# EAGLE design glowproxy.alpha (EAGLE 6.5.0)
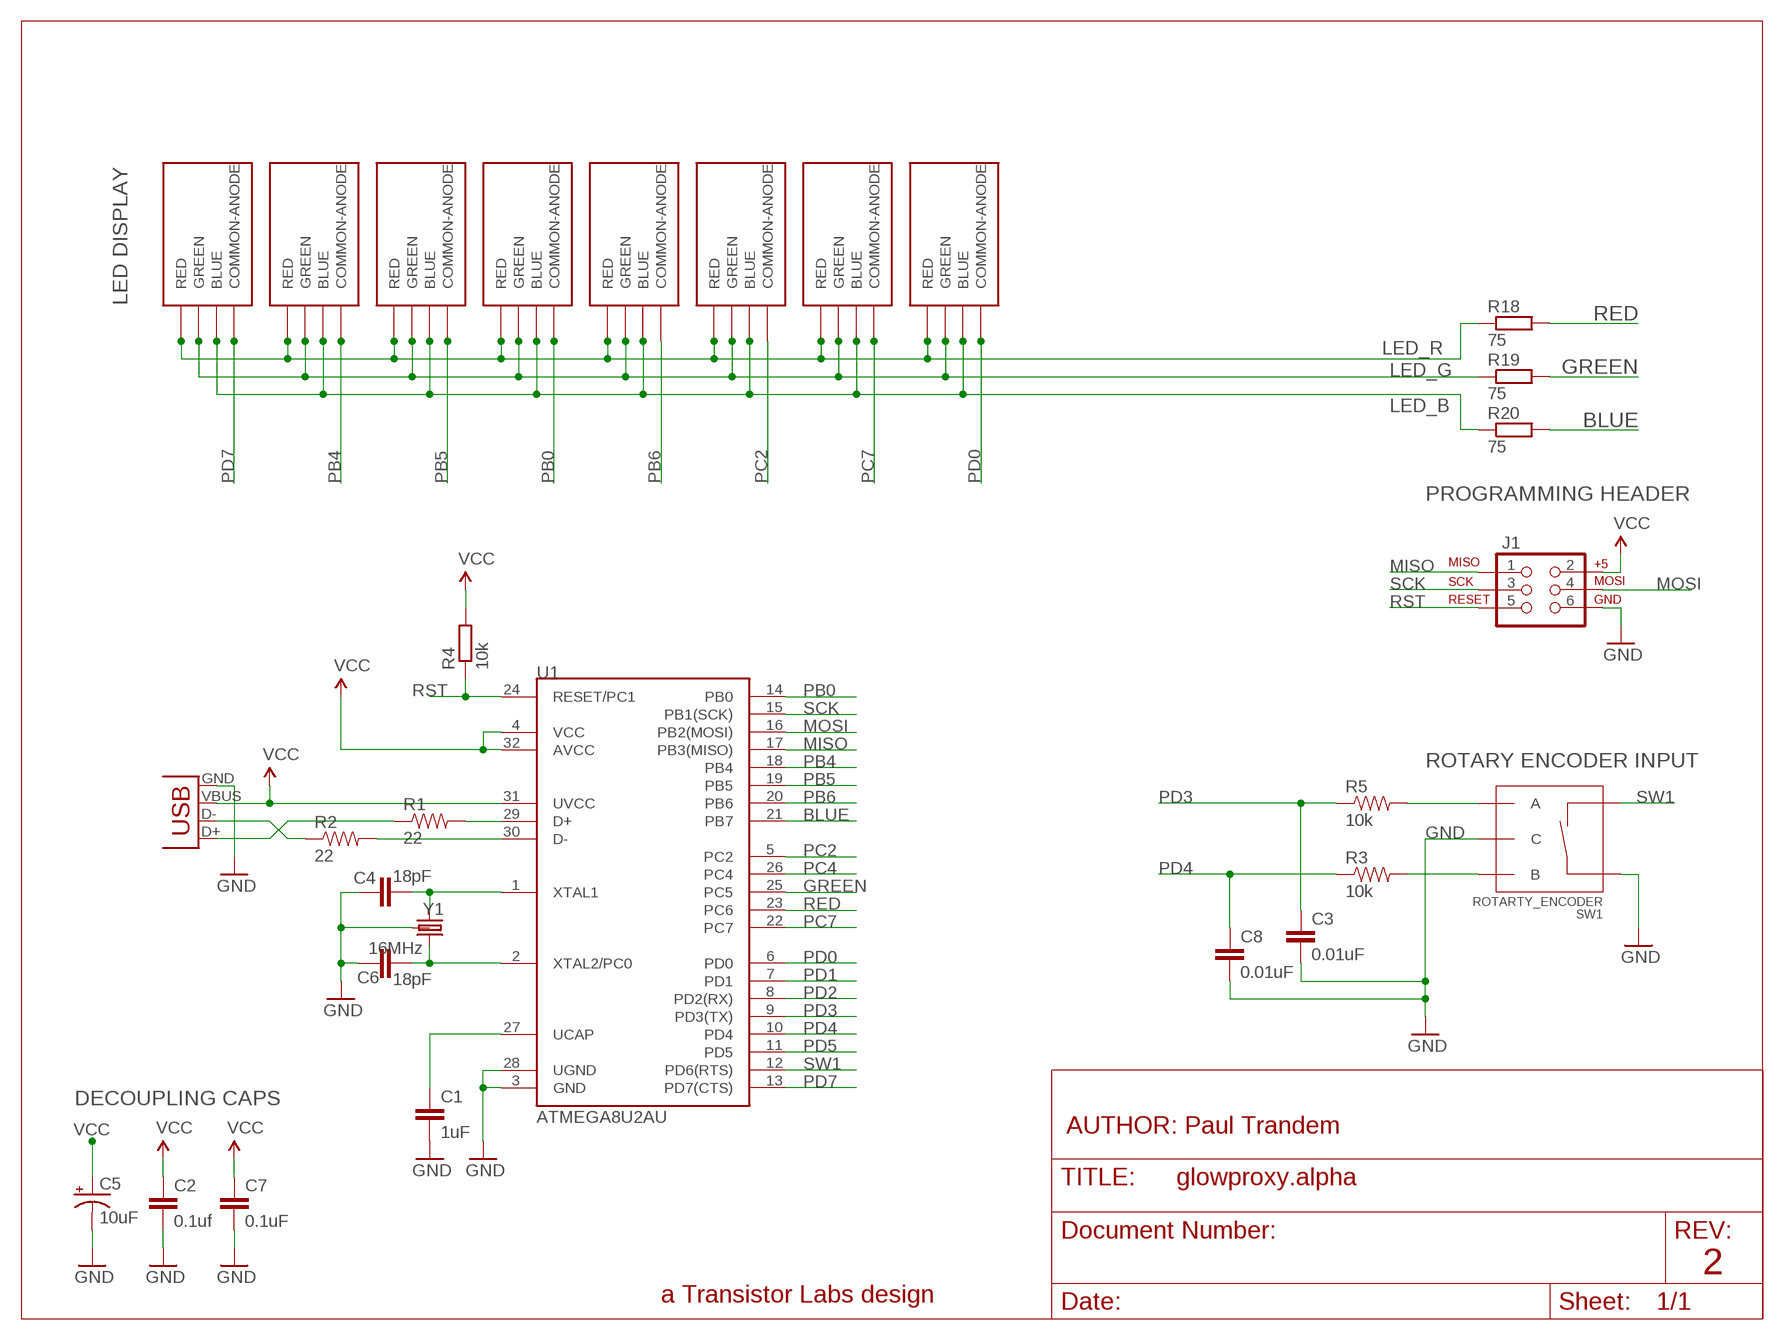
[diagram p0: schematic, sheet 1]

## Parts
C1  1uF  C-EUC0603  [C0603]
C2  0.1uf  C-EUC0603  [C0603]
C3  0.01uF  C-EUC0603  [C0603]
C4  18pF  CAP0603-CAP  [0603-CAP]
C5  10uF  CAP_POL1206  [EIA3216]
C6  18pF  CAP0603-CAP  [0603-CAP]
C7  0.1uF  C-EUC0603  [C0603]
C8  0.01uF  C-EUC0603  [C0603]
J1  AVR_SPI_PRG_6PTH  [2X3]
LED0  RGB-LED-SMD-CLV1A-FKB  [RGB-LED-SMD-CLV1A-FKB]
LED1  RGB-LED-SMD-CLV1A-FKB  [RGB-LED-SMD-CLV1A-FKB]
LED2  RGB-LED-SMD-CLV1A-FKB  [RGB-LED-SMD-CLV1A-FKB]
LED3  RGB-LED-SMD-CLV1A-FKB  [RGB-LED-SMD-CLV1A-FKB]
LED4  RGB-LED-SMD-CLV1A-FKB  [RGB-LED-SMD-CLV1A-FKB]
LED5  RGB-LED-SMD-CLV1A-FKB  [RGB-LED-SMD-CLV1A-FKB]
LED6  RGB-LED-SMD-CLV1A-FKB  [RGB-LED-SMD-CLV1A-FKB]
LED7  RGB-LED-SMD-CLV1A-FKB  [RGB-LED-SMD-CLV1A-FKB]
R1  22  RESISTOR0603-RES  [0603-RES]
R2  22  RESISTOR0603-RES  [0603-RES]
R3  10k  RESISTOR0603-RES  [0603-RES]
R4  10k  R-EU_R0603  [R0603]
R5  10k  RESISTOR0603-RES  [0603-RES]
R18  75  R-EU_R0603  [R0603]
R19  75  R-EU_R0603  [R0603]
R20  75  R-EU_R0603  [R0603]
SW1  ROTARTY_ENCODER  [ROTARY_ENC_PLAIN]
U1  ATMEGA8U2AU  [TQFP32-08]
X1  USBSMD  [USB-MINIB]
Y1  16MHz  CRYSTAL5X3  [CRYSTAL-SMD-5X3]

## Nets
BLUE: R20.2 U1.21(PB7)
DP_N: R2.2 U1.30(D-)
DP_P: R1.2 U1.29(D+)
GND: C1.2 C2.2 C3.2 C4.2 C5.C(-) C6.2 C7.2 C8.2 J1.6 SW1.C SW1.SW+ U1.3(GND) U1.28(UGND) X1.GND Y1.2(GND) Y1.4(GND)
GREEN: R19.2 U1.25(PC5)
LED_B: LED0.BLUE LED1.BLUE LED2.BLUE LED3.BLUE LED4.BLUE LED5.BLUE LED6.BLUE LED7.BLUE R20.1
LED_G: LED0.GREEN LED1.GREEN LED2.GREEN LED3.GREEN LED4.GREEN LED5.GREEN LED6.GREEN LED7.GREEN R19.1
LED_R: LED0.RED LED1.RED LED2.RED LED3.RED LED4.RED LED5.RED LED6.RED LED7.RED R18.1
MISO: J1.1 U1.17(PB3(MISO))
MOSI: J1.4 U1.16(PB2(MOSI))
N$1: R5.2 SW1.A
N$2: R3.2 SW1.B
N$8: C4.1 U1.1(XTAL1) Y1.3
N$9: C6.1 U1.2(XTAL2/PC0) Y1.1
N$12: C1.1 U1.27(UCAP)
PB0: LED4.COMMON-ANODE U1.14(PB0)
PB4: LED0.COMMON-ANODE U1.18(PB4)
PB5: LED7.COMMON-ANODE U1.19(PB5)
PB6: LED5.COMMON-ANODE U1.20(PB6)
PC2: LED1.COMMON-ANODE U1.5(PC2)
PC4: U1.26(PC4)
PC7: LED6.COMMON-ANODE U1.22(PC7)
PD0: LED2.COMMON-ANODE U1.6(PD0)
PD1: U1.7(PD1)
PD2: U1.8(PD2(RX))
PD3: C3.1 R5.1 U1.9(PD3(TX))
PD4: C8.1 R3.1 U1.10(PD4)
PD5: U1.11(PD5)
PD7: LED3.COMMON-ANODE U1.13(PD7(CTS))
RED: R18.2 U1.23(PC6)
RST: J1.5 R4.1 U1.24(RESET/PC1)
SCK: J1.3 U1.15(PB1(SCK))
SW1: SW1.SW- U1.12(PD6(RTS))
USBD_N: R2.1 X1.D-
USBD_P: R1.1 X1.D+
VCC: C2.1 C5.A(+) C7.1 J1.2 R4.2 U1.4(VCC) U1.31(UVCC) U1.32(AVCC) X1.VBUS

## Notes on the sheet
- LED DISPLAY
- PROGRAMMING HEADER
- ROTARY ENCODER INPUT
- DECOUPLING CAPS
- AUTHOR: Paul Trandem
- 2
- a Transistor Labs design

## Library data of the parts
C1-C3 C7 C8 = TransistorLabs.Resistor.mod:C-EU: CAPACITOR, European symbol
C4 C6 = SparkFun:CAP: Capacitor Standard 0603 ceramic capacitor, and 0.1" leaded capacitor.
C5 = SparkFun:CAP_POL: Capacitor Polarized These are standard SMD and PTH capacitors. Normally 10uF, 47uF, and 100uF in electrolytic and tantalum varieties. Always verify the external diameter of the through hole cap, it varies with capacity, voltage, and manufacturer. The EIA devices should be standard.
J1 = SparkFun:AVR_SPI_PRG_6: AVR ISP 6 Pin This is the reduced ISP connector for AVR programming. Common on Arduino. This footprint will take up less PCB space and can be used with a 10-pin to 6-pin adapter such as SKU: BOB-08508
LED0 LED1-LED7 = thump:RGB-LED-SMD-CLV1A-FKB: RGB LED PLCC4 CREE CLV1A-FKB
R1-R3 R5 = SparkFun:RESISTOR: Resistor Basic schematic elements and footprints for 0603, 1206, and PTH resistors.
R4 R18-R20 = TransistorLabs.Resistor.mod:R-EU_: RESISTOR, European symbol
SW1 = SparkFun-Electromechanical:ROTARTY_ENCODER: Simple no LED rotary encoder Example: COM-09117
U1 = SparkFun:ATMEGA8U2: Atmel 8-bit Microcontroller with 8/16/32K Bystes of ISP Flash and USB Controller. ATmega8U2, ATmega16U2, and ATmega32U2
X1 = SparkFun:USB: USB Connectors USB-B-PTH is fully proven SKU : PRT-00139 USB-miniB is fully proven SKU : PRT-00587 USB-A-PCB is untested. USB-A-H is throughly reviewed, but untested. Spark Fun Electronics SKU : PRT-00437 USB-B-SMT is throughly reviewed, but untested. Needs silkscreen touching up. USB-A-S has not been used/tested USB-MB-H has not been used/tested
Y1 = Transistorlabs:CRYSTAL: Custom crystals

## Board
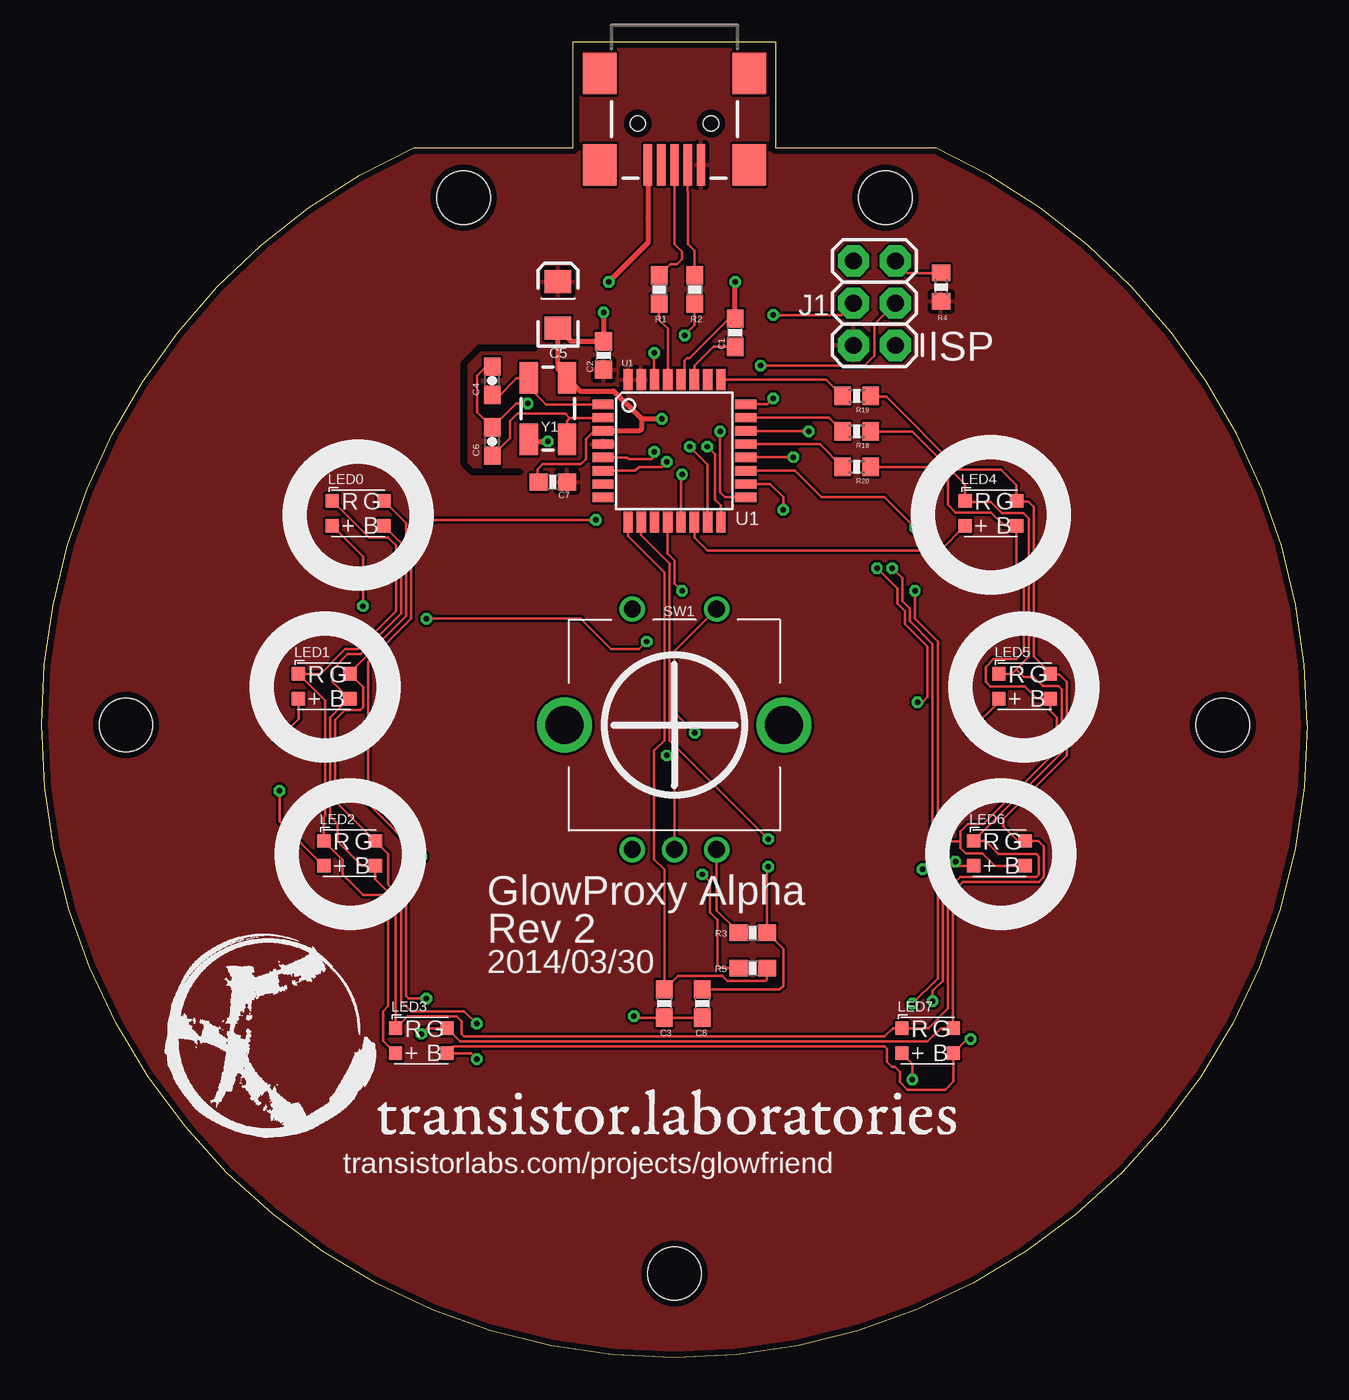
[diagram p1: board, top side]
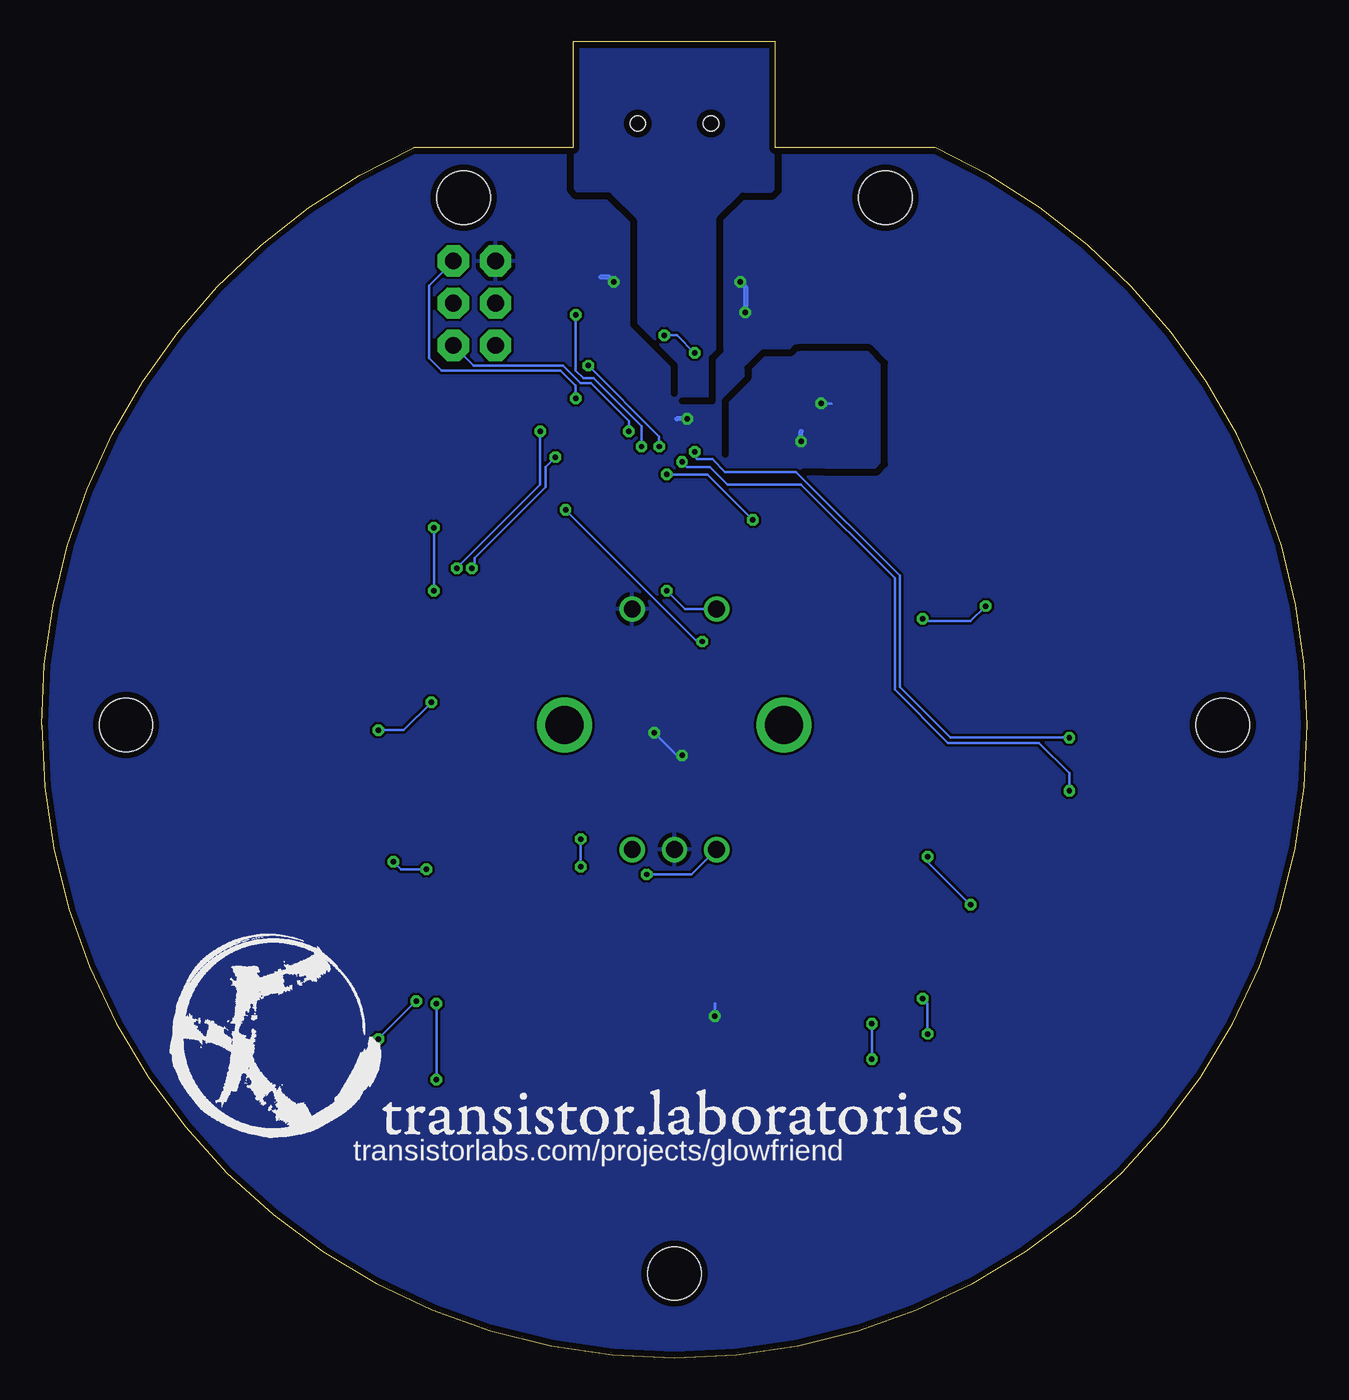
[diagram p2: board, bottom side, seen from below]

Size 76.2 x 79.25 mm. Coordinates in mm from the lower left corner, seen from the top.
Outline: 76.2,38.1 arc-180 0,38.1 arc-66 22.4,72.85 32,72.85 32,79.25 44.2,79.25 44.2,72.85 53.8,72.85 arc-66 76.2,38.1
Copper layers (1*16): Top 0.0356mm / dielectric 1.5011mm / Bottom 0.0356mm
Design rules "LaenPCBOrder": minimum track width 6mil, minimum drill 13mil, track to track 6mil, track to pad 6mil, pad to pad 6mil, via to via 6mil, smd to smd 6mil, copper to edge 15mil, drill to drill 6mil, minimum pad ring 7mil, minimum via ring 7mil, stop-mask expansion 3mil, vias tented up to drill 0mil, thermal gap 10mil
Holes 3.2 mm at 5.08,38.1 71.12,38.1 38.1,5.08 25.4,69.85 50.8,69.85
tRestrict: 5 lines
bRestrict: 27 lines

### Footprints (pad centres in the part's own frame; a part is rotated, then mirrored left to right if it is on the bottom)
C0603 = smd 1.1 x 1: 1 -0.85,0; 2 0.85,0
0603-CAP = smd 1.1 x 1: 1 -0.85,0; 2 0.85,0
EIA3216 = smd 1.4 x 1.6: A 1.4,0; C -1.4,0
2X3 = drill 1.016 pad 1.88 octagon: 1 0,0; 2 0,2.54; 3 2.54,0; 4 2.54,2.54; 5 5.08,0; 6 5.08,2.54
RGB-LED-SMD-CLV1A-FKB = smd 0.8 x 0.8: BLUE 1.55,-0.7; COMMON-ANODE -1.55,-0.7; GREEN 1.55,0.8; RED -1.55,0.8
0603-RES = smd 1.1 x 1: 1 -0.85,0; 2 0.85,0
R0603 = smd 1 x 1.1: 1 -0.85,0; 2 0.85,0
ROTARY_ENC_PLAIN = drill 1.016: A 7.493,-2.54; B 7.493,2.54; C 7.493,0; SW+ -6.985,2.54; SW- -6.985,-2.54 | drill 2.286: P$3 0,6.604; P$4 0,-6.604
TQFP32-08 = smd 1.27 x 0.559: 1 -4.293,2.8; 2 -4.293,2; 3 -4.293,1.2; 4 -4.293,0.4; 5 -4.293,-0.4; 6 -4.293,-1.2; 7 -4.293,-2; 8 -4.293,-2.8; 17 4.293,-2.8; 18 4.293,-2; 19 4.293,-1.2; 20 4.293,-0.4; 21 4.293,0.4; 22 4.293,1.2; 23 4.293,2; 24 4.293,2.8 | smd 0.559 x 1.27: 9 -2.8,-4.293; 10 -2,-4.293; 11 -1.2,-4.293; 12 -0.4,-4.293; 13 0.4,-4.293; 14 1.2,-4.293; 15 2,-4.293; 16 2.8,-4.293; 25 2.8,4.293; 26 2,4.293; 27 1.2,4.293; 28 0.4,4.293; 29 -0.4,4.293; 30 -1.2,4.293; 31 -2,4.293; 32 -2.8,4.293
USB-MINIB = smd 2.5 x 0.5: D+ 2.5,0; D- 2.5,0.8; GND 2.5,-1.6; ID 2.5,-0.8; VBUS 2.5,1.6 | smd 2.5 x 2: MTN1 -3,4.5; MTN2 2.5,4.5; MTN3 -3,-4.5; MTN4 2.5,-4.5 | hole 0.9: 0,2.2; 0,-2.2
CRYSTAL-SMD-5X3 = smd 1.9 x 1.1: 1 -1.85,-1.15; 2 1.85,-1.15; 3 1.85,1.15; 4 -1.85,1.15

### Placement (x,y rotation side)
C1  41.76,61.72 90 top
C2  33.83,60.35 90 top
C3  37.49,21.34 270 top
C4  27.13,58.83 90 top
C5  31.09,63.4 90 top
C6  27.13,55.17 90 top
C7  30.78,52.73 180 top
C8  39.78,21.34 270 top
J1  51.41,60.96 90 top
LED0  19.05,50.8 0 top
LED1  17.02,40.39 0 top
LED2  18.54,30.33 0 top
LED3  22.86,19.05 0 top
LED4  57.15,50.8 0 top
LED5  59.18,40.39 0 top
LED6  57.66,30.33 0 top
LED7  53.34,19.05 0 top
R1  37.19,64.31 270 top
R2  39.32,64.31 270 top
R3  42.82,25.6 180 top
R4  54.15,64.47 270 top
R5  42.82,23.47 180 top
R18  49.07,55.78 180 top
R19  49.07,57.91 180 top
R20  49.07,53.64 180 top
SW1  38.1,38.1 270 top
U1  38.1,54.61 0 top
U$1  [TL-LOGO]  6.4,19.05 0 top
U$2  [TL-LOGO]  69.49,19.05 0 bottom
X1  38.1,74.32 270 top
Y1  30.48,57.15 90 top

### Tracks (layer width: path | path; a pad name or v marks a point on that pad's centre or on a via)
BLUE
  Top 0.152: U1.21 46.86,55.01 R20.2
DP_N  (via drill 0.33)
  Top 0.152: R2.2 39.32,62.18 v38.71,61.57 | v36.88,60.5 36.88,58.92 U1.30
  Bottom 0.152: v38.71,61.57 37.95,61.57 v36.88,60.5
DP_P
  Top 0.152: R1.2 37.19,62.48 37.7,61.97 U1.29
GND  (via drill 0.33)
  Top 0.152: SW1.SW+ 38.1,42.55 38.1,38.86 v39.32,37.64 | v37.64,36.27 38.1,35.81 SW1.C | v29.26,57.45 28.56,57.45 C6.2 26.21,56.93 26.21,59.13 26.76,59.68 C4.2 | C7.2 29.87,52.8 29.87,53.49 30.18,53.8 32.46,53.8 32.77,54.1 32.77,55.32 33.26,55.81 U1.3 | U1.28 38.71,59.11 38.71,60.05 38.86,60.2 39.01,60.2 41.39,62.57 C1.2 | C8.2 C3.2 35.75,20.49 v35.66,20.57
  Top 0.305: X1.GND 36.5,68.62 36.5,67.13 v34.14,64.77 34.14,64.85 | v33.83,62.94 C2.2 31.89,61.2 C5.C 31.09,59.54 Y1.2 32.41,58.22 34.44,58.22 36.12,56.54 | 36.12,56.54 36.12,55.93 36,55.81 U1.3 | C1.2 v41.76,64.77 | 36.12,56.54 v37.34,56.54 | Y1.4 29.46,55.17 v30.48,55.17
  Bottom 0.152: v39.32,37.64 37.95,36.27 v37.64,36.27 | v29.26,57.45 28.65,57.45 | v35.66,20.57 35.66,21.34
  Bottom 0.305: v34.14,64.77 33.83,64.47 v33.83,62.94 | v41.76,64.77 42.06,65.08 42.52,65.08 | v37.34,56.54 37.95,56.54 | v30.48,55.17 30.48,55.78
  pour Bottom: -0.15,38.56 -0.3,39.62 arc-90 38.86,80.31 arc-90 76.05,29.87 arc-68 41.61,-1.22 arc-90
GREEN
  Top 0.152: U1.25 47.23,58.9 R19.2
LED_B  (via drill 0.33)
  Top 0.152: R20.1 54.1,53.65 54.56,53.19 54.56,51.36 55.02,50.9 57.15,50.9 57.95,50.1 LED4.BLUE 58.67,50.07 58.67,47.7 59.13,47.24 59.13,42.52 58.67,42.06 57.3,42.06 56.84,41.6 56.84,40.69 57.12,40.41 59.21,40.41 59.93,39.69 LED5.BLUE 60.73,38.94 61.11,38.56 61.11,36.58 56.69,32.16 55.78,32.16 55.32,31.7 55.32,31.09 | v53.65,21.49 53.65,22.1 54.25,22.71 54.25,30.63 54.71,31.09 55.32,31.09 | v55.93,19.2 55.74,19.2 LED7.BLUE 54.89,16.64 54.41,16.15 52.12,16.15 51.66,16.61 51.66,17.22 51.36,17.53 51.21,17.53 50.9,17.83 50.9,18.59 50.75,18.75 24.8,18.75 LED3.BLUE 25.85,18.35 v26.21,17.98 | 20.57,50.07 LED0.BLUE 21.64,49.06 21.64,44.81 19.2,42.37 18.44,42.37 17.53,41.45 17.53,40.69 18.53,39.69 LED1.BLUE 18.5,39.69 17.37,38.56 17.37,32.61 17.83,32.16 17.83,31.09 19.29,29.63 LED2.BLUE 20.09,28.83 21.64,27.28 21.64,21.49 22.25,20.88 25.45,20.88 v26.21,20.12 | 55.32,31.09 55.32,30.71 55.65,30.38 56.64,30.38 57.39,29.63 LED6.BLUE
  Bottom 0.152: v53.65,21.49 v55.93,19.2 | v26.21,20.12 v26.21,17.98
LED_G  (via drill 0.33)
  Top 0.152: R19.1 49.97,57.86 50.85,57.86 55.22,53.49 57.76,53.49 58.7,52.55 LED4.GREEN 58.74,51.56 59.41,51.56 59.74,51.23 59.74,42.22 60.73,41.22 LED5.GREEN 60.77,41.15 61.27,41.15 61.72,40.69 61.72,36.27 57.91,32.46 57.91,32 58.79,31.13 LED6.GREEN 60.01,31.13 60.35,30.79 60.35,28.96 60.05,28.65 55.47,28.65 54.86,28.04 54.86,19.88 LED7.GREEN 54.14,19.85 53.34,19.05 25.21,19.05 LED3.GREEN 23.2,19.85 v22.86,19.51 | v23.16,21.64 22.1,21.64 21.95,21.79 21.95,27.43 20.88,28.5 20.88,30.34 LED2.GREEN 17.68,33.54 17.68,38.41 18.29,39.01 19.2,39.01 19.36,39.17 19.36,40.4 LED1.GREEN 18.57,41.28 21.95,44.65 21.95,50.25 LED0.GREEN
  Bottom 0.152: v23.16,21.64 22.86,21.34 v22.86,19.51
LED_R
  Top 0.152: R18.1 52.43,55.78 55.6,52.6 LED4.RED 55.69,51.51 57.15,51.51 57.81,50.85 59.11,50.85 59.44,50.52 59.44,42.22 58.67,41.45 | LED0.RED 19.72,49.38 20.88,49.38 21.34,48.92 21.34,44.96 19.05,42.67 18.29,42.67 16.8,41.19 LED1.RED 17.07,39.59 17.07,32.61 16.99,32.54 LED2.RED 18.14,29.98 18.14,29.11 19.36,27.89 20.57,27.89 21.31,27.15 LED3.RED 22.03,20.57 24.99,20.57 25.3,20.27 25.3,19.51 25.45,19.36 50.75,19.36 51.24,19.85 LED7.RED 53.38,19.85 54.56,21.03 54.56,28.19 55.32,28.96 59.89,28.96 60.05,29.11 60.05,30.18 59.89,30.33 57.61,30.33 56.81,31.13 LED6.RED 61.42,36.44 61.42,40.23 61.21,40.44 60.27,40.44 59.72,41 59.13,41 58.67,41.45 | 58.67,41.45 58.41,41.19 LED5.RED
MISO  (via drill 0.33)
  Top 0.152: U1.17 41.15,51.81 40.84,52.12 v40.84,55.78
  Bottom 0.152: v40.84,55.78 40.84,56.39 43.13,58.67 43.74,58.67 44.81,59.74 50.19,59.74 J1.1
MOSI  (via drill 0.33)
  Top 0.152: U1.16 40.9,51.3 40.54,51.66 40.54,54.41 v40.08,54.86 | v44.04,62.79 48.16,62.79 J1.4
  Bottom 0.152: v40.08,54.86 40.08,56.08 42.98,58.98 43.59,58.98 44.04,59.44 v44.04,62.79
N$1  (via drill 0.33)
  Top 0.152: R5.2 40.84,23.47 40.69,23.62 40.69,26.36 40.23,26.82 40.23,28.65 v39.78,29.11
  Bottom 0.152: v39.78,29.11 37.06,29.11 SW1.A
N$2
  Top 0.152: SW1.B 40.64,26.94 R3.2
N$8
  Top 0.152: U1.1 30.38,57.4 29.33,58.45 Y1.3 29.31,58.98 28.6,58.98 27.6,57.98 C4.1
N$9
  Top 0.152: U1.2 33.79,56.59 31.8,56.59 | Y1.1 31.62,56.41 31.8,56.59 | C6.1 28.19,55.39 28.19,56.39 28.65,56.84 31.55,56.84 31.8,56.59
N$12
  Top 0.152: U1.27 39.32,58.92 39.32,59.74 40.45,60.87 C1.1
PB0
  Top 0.152: LED4.COMMON-ANODE 54.12,48.62 40.08,48.62 39.3,49.4 U1.14
PB4  (via drill 0.33)
  Top 0.152: 17.87,50.1 LED0.COMMON-ANODE 19.36,48.24 v19.36,45.26 | v23.16,44.5 32.46,44.5 34.29,42.67 35.97,42.67 v36.42,43.13 | v44.65,51.05 44.65,51.82 43.86,52.61 U1.18
  Bottom 0.152: v23.16,44.5 23.01,44.35 20.27,44.35 v19.36,45.26 | v36.42,43.13 36.73,43.13 v44.65,51.05
PB5  (via drill 0.33)
  Top 0.152: U1.19 45.34,53.41 46.94,51.82 50.75,51.82 v52.58,49.99 | v52.43,21.34 53.95,22.86 53.95,43.13 52.58,44.5 v52.58,46.18 | v52.43,16.76 52.43,17.71 LED7.COMMON-ANODE
  Bottom 0.152: v52.43,21.34 v52.43,16.76 | v52.58,49.99 v52.58,46.18
PB6  (via drill 0.33)
  Top 0.152: U1.20 42.41,54.23 v45.26,54.23 | v50.29,47.55 51.51,46.33 51.51,45.41 51.97,44.96 51.97,44.2 53.34,42.82 53.34,39.78 53.03,39.47 v52.73,39.47 | v55.93,37.8 57.63,39.5 LED5.COMMON-ANODE
  Bottom 0.152: v45.26,54.23 45.87,53.62 45.87,52.43 50.14,48.16 50.14,47.7 v50.29,47.55 | v52.73,39.47 54.41,37.8 v55.93,37.8
PC2  (via drill 0.33)
  Top 0.152: v14.33,37.34 15.47,38.48 LED1.COMMON-ANODE | v36.88,54.56 36.88,54.25 36.73,54.1 35.36,54.1 35.25,54.21 U1.5
  Bottom 0.152: v14.33,37.34 21.49,37.34 24.54,40.39 24.54,47.09 30.79,53.34 35.05,53.34 35.81,54.1 36.73,54.1 36.88,54.25 v36.88,54.56
PC7  (via drill 0.33)
  Top 0.152: U1.22 46.15,55.81 v46.18,55.78 | v51.21,47.55 51.82,46.94 51.82,45.57 52.27,45.11 52.27,44.35 53.65,42.98 53.65,29.87 53.19,29.41 v53.03,29.41 | LED6.COMMON-ANODE 55.26,29.63 v55.02,29.87
  Bottom 0.152: v46.18,55.78 46.18,52.58 v51.21,47.55 | v55.02,29.87 54.56,29.41 v53.03,29.41
PD0  (via drill 0.33)
  Top 0.152: v14.33,34.14 14.33,32.29 LED2.COMMON-ANODE | v37.64,53.95 37.34,53.65 35.97,53.65 35.73,53.41 U1.6
  Bottom 0.152: v14.33,34.14 14.33,35.2 16.15,37.03 21.64,37.03 24.84,40.23 24.84,46.94 30.48,52.58 34.9,52.58 35.97,53.65 37.34,53.65 v37.64,53.95
PD3
  Top 0.152: U1.9 35.31,49.48 37.49,47.3 37.49,37.19 36.88,36.58 36.88,30.02 37.49,29.41 C3.1 38.32,23.01 41,23.01 41.3,22.71 43.59,22.71 43.67,22.8 R5.1
PD4  (via drill 0.33)
  Top 0.152: U1.10 36.09,49.53 37.8,47.83 37.8,37.19 v43.74,31.24 | C8.1 44.44,22.19 44.65,22.4 44.65,24.62 R3.1 43.67,29.5 v43.74,29.57
  Bottom 0.152: v43.74,29.57 v43.74,31.24
PD7  (via drill 0.33)
  Top 0.152: LED3.COMMON-ANODE 20.57,19.09 20.57,20.88 20.88,21.18 20.88,26.52 20.27,27.13 v20.27,27.28 20.27,27.2 | v38.56,53.19 38.5,53.13 U1.13 | v33.38,50.44 23.62,50.44 22.25,49.07 22.25,44.5 19.66,41.91 19.66,33.38 v22.86,30.18
  Bottom 0.152: v20.27,27.28 22.86,29.87 v22.86,30.18 | v33.38,50.44 36.12,53.19 v38.56,53.19
RED
  Top 0.152: U1.23 47.39,56.61 R18.2
RST  (via drill 0.33)
  Top 0.152: U1.24 43.69,57.41 v44.04,57.76 | R4.1 52.13,65.31 J1.5
  Bottom 0.152: v44.04,57.76 44.04,58.52 44.96,59.44 52.12,59.44 52.88,60.2 52.88,64.57 J1.5
SCK  (via drill 0.33)
  Top 0.152: U1.15 40.1,53.78 v39.01,54.86 | v43.28,59.74 49.53,59.74 50.14,60.35 50.14,62.23 J1.3
  Bottom 0.152: v39.01,54.86 39.01,55.47 v43.28,59.74
SW1  (via drill 0.33)
  Top 0.152: U1.12 37.69,48.41 38.1,48.01 38.1,46.63 v38.56,46.18
  Bottom 0.152: v38.56,46.18 37.47,45.09 SW1.SW-
USBD_N
  Top 0.152: X1.D- 38.91,68.61 38.91,67.06 39.32,66.65 R2.1
USBD_P
  Top 0.152: R1.1 37.86,65.84 38.25,65.84 38.56,66.14 38.56,66.6 38.1,67.06 X1.D+
VCC
  pour Top: 0.46,39.47 0.46,40.08 arc-90 38.25,80.31 arc-90 76.05,40.84 76.35,37.19 arc-92 37.19,-0.76 arc-92

### Text on the board
tPlace: ISP | U1 | GlowProxy Alpha | Rev 2 | 2014/03/30 | transistorlabs.com/projects/glowfriend
bPlace: transistorlabs.com/projects/glowfriend